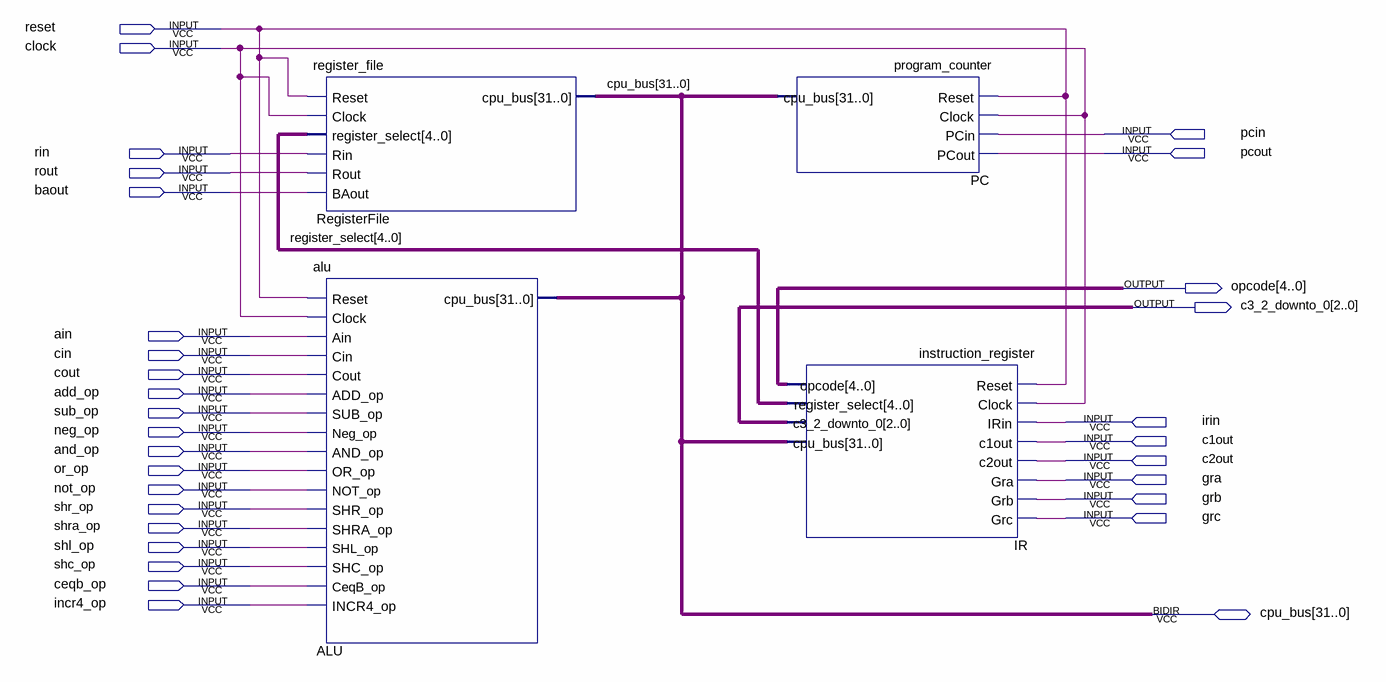
[diagram p0: schematic sheet]
// Quartus schematic Datapath.bdf as structural Verilog: 4 symbols, 31 pins
module Datapath (
  input  reset,
  input  clock,
  input  pcin,
  input  rin,
  input  pcout,
  input  rout,
  input  baout,
  input  ain,
  input  cin,
  input  cout,
  input  add_op,
  input  sub_op,
  input  irin,
  input  neg_op,
  input  c1out,
  input  and_op,
  input  c2out,
  input  or_op,
  input  gra,
  input  not_op,
  input  grb,
  input  shr_op,
  input  grc,
  input  shra_op,
  input  shl_op,
  input  shc_op,
  input  ceqb_op,
  input  incr4_op,
  inout  [31:0] cpu_bus,
  output [4:0] opcode,
  output [2:0] c3_2_downto_0
);

  wire [4:0] register_select;

  register_file RegisterFile (
    .Reset(reset), .Clock(clock), .register_select(register_select), .Rin(rin), .Rout(rout), .BAout(baout),
    .cpu_bus(cpu_bus));
  alu ALU (
    .Reset(reset), .Clock(clock), .Ain(ain), .Cin(cin), .Cout(cout), .ADD_op(add_op), .SUB_op(sub_op),
    .Neg_op(neg_op), .AND_op(and_op), .OR_op(or_op), .NOT_op(not_op), .SHR_op(shr_op), .SHRA_op(shra_op),
    .SHL_op(shl_op), .SHC_op(shc_op), .CeqB_op(ceqb_op), .INCR4_op(incr4_op), .cpu_bus(cpu_bus));
  program_counter PC (.Reset(reset), .Clock(clock), .PCin(pcin), .PCout(pcout), .cpu_bus(cpu_bus));
  instruction_register IR (
    .Reset(reset), .Clock(clock), .IRin(irin), .c1out(c1out), .c2out(c2out), .Gra(gra), .Grb(grb), .Grc(grc),
    .opcode(opcode), .register_select(register_select), .c3_2_downto_0(c3_2_downto_0), .cpu_bus(cpu_bus));
endmodule
